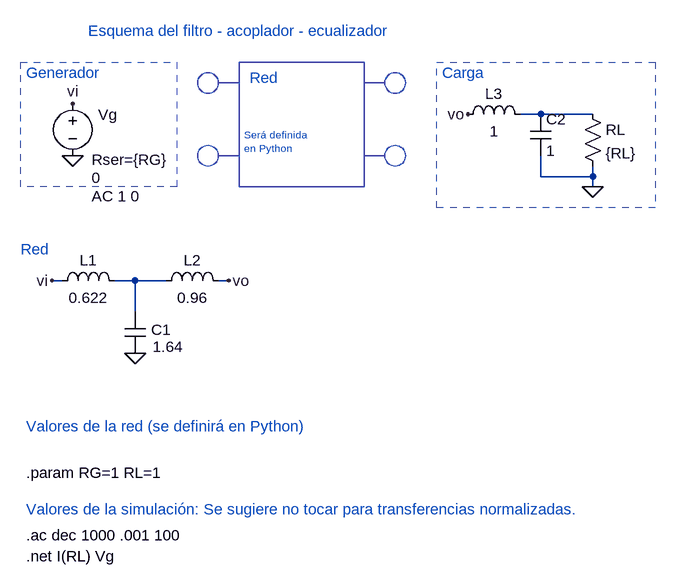
[diagram p0: schematic spar broadband fig 9.8.asc]
spar broadband fig 9.8.asc, the LTspice schematic file:
Version 4
SHEET 1 932 680
WIRE 752 -256 720 -256
WIRE 832 -256 752 -256
WIRE 752 -160 752 -192
WIRE 832 -160 832 -176
WIRE 832 -160 752 -160
WIRE 832 -144 832 -160
WIRE 16 0 0 0
WIRE 128 0 96 0
WIRE 176 0 128 0
WIRE 272 0 256 0
WIRE 128 48 128 0
FLAG 32 -192 0
FLAG 128 112 0
FLAG 832 -144 0
FLAG 32 -272 vi
FLAG 640 -256 vo
FLAG 0 0 vi
FLAG 272 0 vo
SYMBOL voltage 32 -288 R0
WINDOW 3 29 130 Left 2
WINDOW 123 29 158 Left 2
WINDOW 39 29 102 Left 2
WINDOW 0 39 33 Left 2
SYMATTR Value 0
SYMATTR Value2 AC 1 0
SYMATTR SpiceLine Rser={RG}
SYMATTR InstName Vg
SYMBOL res 816 -272 R0
SYMATTR InstName RL
SYMATTR Value {RL}
SYMBOL ind 0 16 R270
WINDOW 0 32 56 VTop 2
WINDOW 3 5 56 VBottom 2
SYMATTR InstName L1
SYMATTR Value 0.622
SYMBOL cap 112 48 R0
WINDOW 0 41 28 Left 2
WINDOW 3 43 54 Left 2
SYMATTR InstName C1
SYMATTR Value 1.64
SYMBOL ind 160 16 R270
WINDOW 0 32 56 VTop 2
WINDOW 3 5 56 VBottom 2
SYMATTR InstName L2
SYMATTR Value 0.96
SYMBOL cap 736 -256 R0
SYMATTR InstName C2
SYMATTR Value 1
SYMBOL ind 624 -240 R270
WINDOW 0 32 56 VTop 2
WINDOW 3 5 56 VBottom 2
SYMATTR InstName L3
SYMATTR Value 1
TEXT -40 424 Left 2 !.net I(RL) Vg
TEXT -40 392 Left 2 !.ac dec 1000 .001 100
TEXT 304 -312 Left 2 ;Red
TEXT -40 -320 Left 2 ;Generador
TEXT 600 -320 Left 2 ;Carga
TEXT 296 -224 Left 1 ;Será definida \nen Python
TEXT -40 224 Left 2 ;Valores de la red (se definirá en Python)
TEXT -40 296 Left 2 !.param RG=1 RL=1
TEXT 56 -384 Left 2 ;Esquema del filtro - acoplador - ecualizador
TEXT -40 352 Left 2 ;Valores de la simulación: Se sugiere no tocar para transferencias normalizadas.
TEXT -48 -48 Left 2 ;Red
LINE Normal 288 -304 256 -304
LINE Normal 288 -192 256 -192
LINE Normal 480 -192 512 -192
LINE Normal 480 -304 512 -304
RECTANGLE Normal 480 -144 288 -336
RECTANGLE Normal 192 -144 -48 -336 2
RECTANGLE Normal 928 -112 592 -336 2
CIRCLE Normal 256 -288 224 -320
CIRCLE Normal 256 -176 224 -208
CIRCLE Normal 512 -208 544 -176
CIRCLE Normal 512 -320 544 -288

The netlist it stands for:
* spar broadband fig 9.8.asc
Vg vi 0 0 AC 1 0 Rser={RG}
RL N001 0 {RL}
L1 vi N002 0.622
C1 N002 0 1.64
L2 N002 vo 0.96
C2 N001 0 1
L3 vo N001 1
.net I(RL) Vg
.ac dec 1000 .001 100
* Red
* Generador
* Carga
* Será definida
* en Python
* Valores de la red (se definirá en Python)
.param RG=1 RL=1
* Esquema del filtro - acoplador - ecualizador
* Valores de la simulación: Se sugiere no tocar para transferencias normalizadas.
* Red
.backanno
.end

* Results of the author's LTspice run, read from the files saved beside the schematic
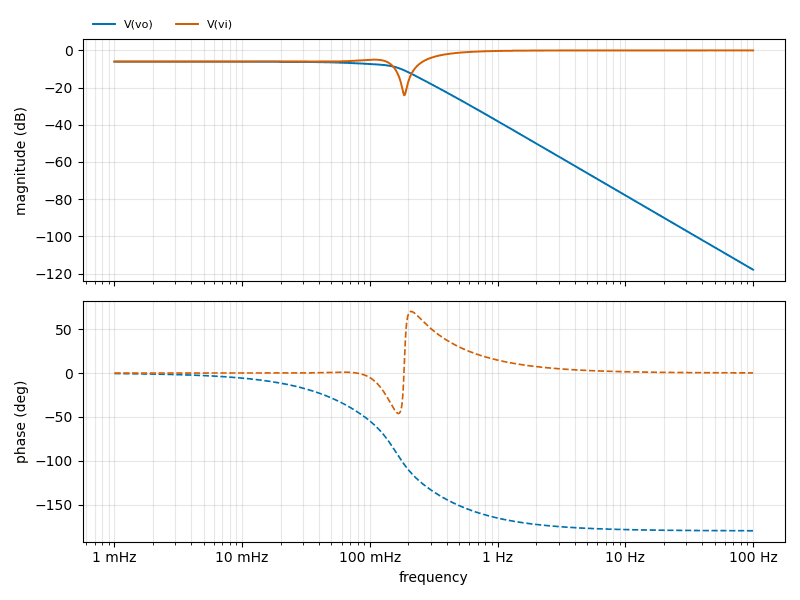
[diagram p1: AC Analysis of spar broadband fig 9.8.asc, plotted from the saved traces]
* AC Analysis, 1 run:
*   V(vo): -6.03 dB at 1 mHz, -117.95 dB at 100 Hz, peak -6.03 dB at 1 mHz, 3 dB below the peak at 159.7 mHz
*   V(vi): -6.01 dB at 1 mHz, -0.00 dB at 100 Hz, peak -0.00 dB at 100 Hz, 3 dB below the peak at 336.4 mHz